# Altium schematic sheet BMS_Schematic.SchDoc
size 431 x 279 mm; SheetNumber: 1; SheetTotal: 1; ENG_APP_DATE: --/--/--; DSN_APP_DATE: --/--/--; CHK_APP_DATE: --/--/--
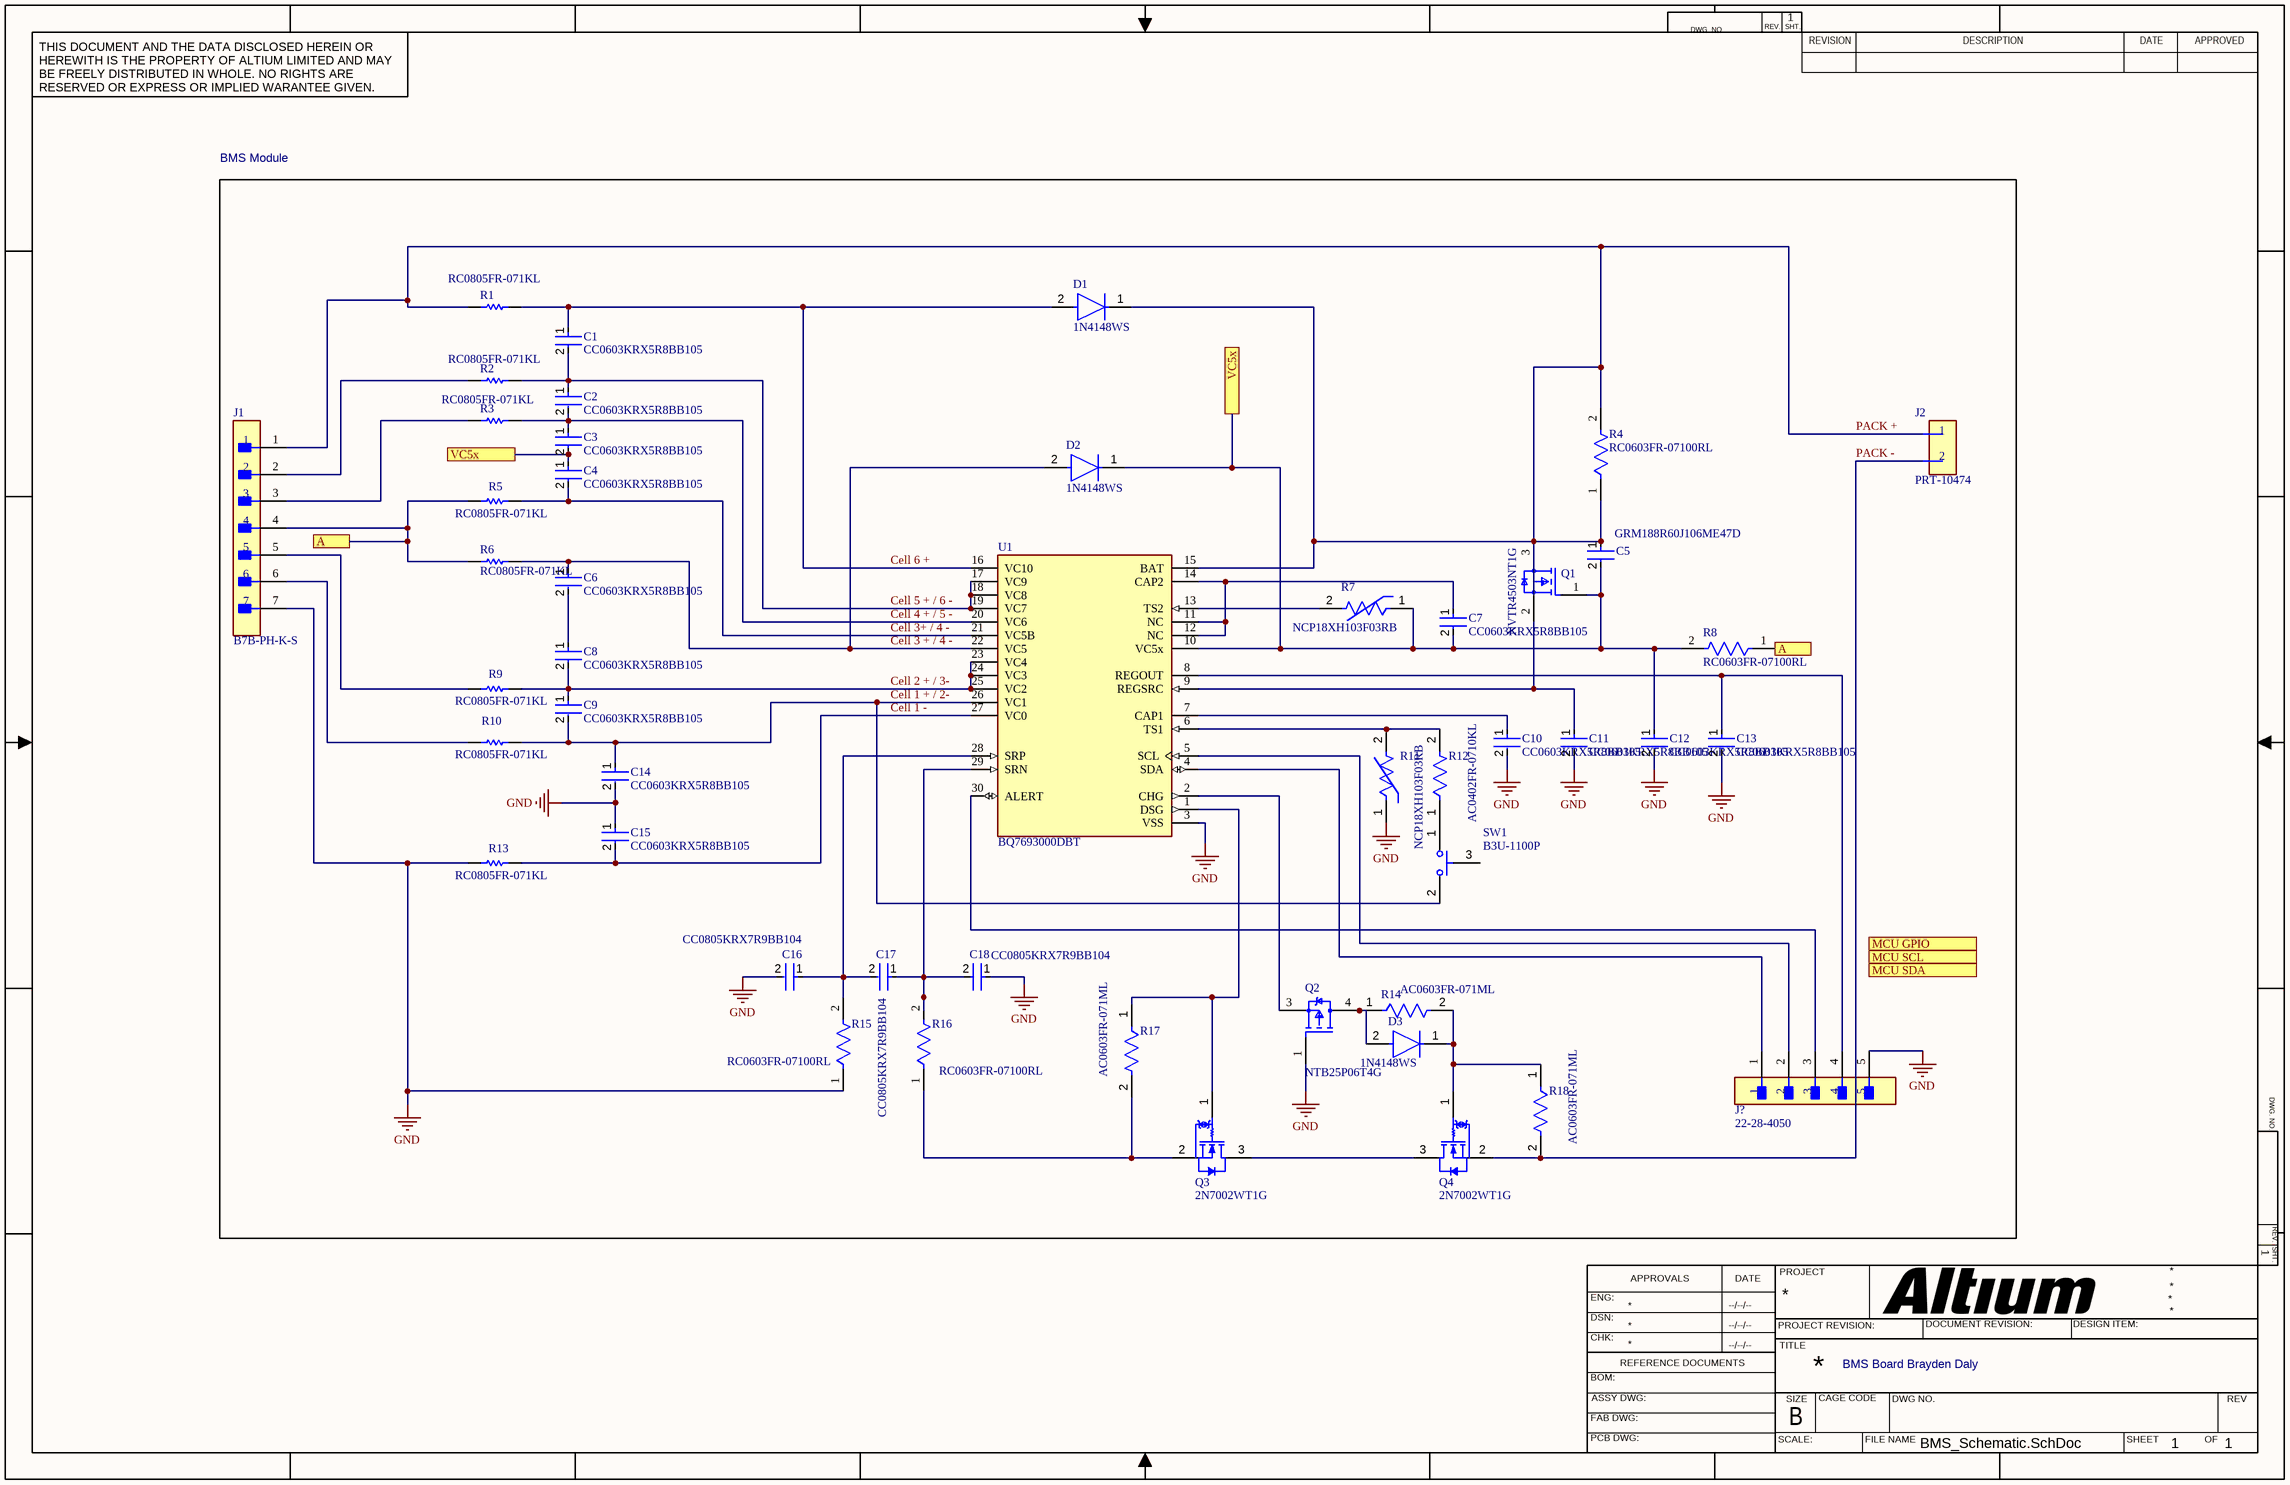
[diagram p0: BMS_Schematic.SchDoc]

## Parts
C1  CC0603KRX5R8BB105  [FP-CC0603-DA-MFG]
C2  CC0603KRX5R8BB105  [FP-CC0603-DA-MFG]
C3  CC0603KRX5R8BB105  [FP-CC0603-DA-MFG]
C4  CC0603KRX5R8BB105  [FP-CC0603-DA-MFG]
C5  GRM188R60J106ME47D  [FP-GRM188-0_1-e0_2_0_55-IPC_A]
C6  CC0603KRX5R8BB105  [FP-CC0603-DA-MFG]
C7  CC0603KRX5R8BB105  [FP-CC0603-DA-MFG]
C8  CC0603KRX5R8BB105  [FP-CC0603-DA-MFG]
C9  CC0603KRX5R8BB105  [FP-CC0603-DA-MFG]
C10  CC0603KRX5R8BB105  [FP-CC0603-DA-MFG]
C11  CC0603KRX5R8BB105  [FP-CC0603-DA-MFG]
C12  CC0603KRX5R8BB105  [FP-CC0603-DA-MFG]
C13  CC0603KRX5R8BB105  [FP-CC0603-DA-MFG]
C14  CC0603KRX5R8BB105  [FP-CC0603-DA-MFG]
C15  CC0603KRX5R8BB105  [FP-CC0603-DA-MFG]
C16  CC0805KRX7R9BB104  [FP-CC0805-0_85-MFG]
C17  CC0805KRX7R9BB104  [FP-CC0805-0_85-MFG]
C18  CC0805KRX7R9BB104  [FP-CC0805-0_85-MFG]
D1  1N4148WS  [FP-477AB-IPC_C]
D2  1N4148WS  [FP-477AB-IPC_C]
D3  1N4148WS  [FP-477AB-IPC_C]
J1  B7B-PH-K-S  [FP-B7B-PH-K-S-MFG]
J2  PRT-10474  [FP-PRT-10474-MFG]
J?  22-28-4050  [FP-22-28-4050-MFG]
Q1  NVTR4503NT1G  [On_Semiconductor_318-08_MFG]
Q2  NTB25P06T4G  [FP-418B-04-MFG]
Q3  2N7002WT1G  [ONSC-SC-70-3-419-04_V]
Q4  2N7002WT1G  [ONSC-SC-70-3-419-04_V]
R1  RC0805FR-071KL  [RESC2013X60X35ML10T20]
R2  RC0805FR-071KL  [RESC2013X60X35ML10T20]
R3  RC0805FR-071KL  [RESC2013X60X35ML10T20]
R4  RC0603FR-07100RL  [FP-RC0603-0_55-MFG]
R5  RC0805FR-071KL  [RESC2013X60X35ML10T20]
R6  RC0805FR-071KL  [RESC2013X60X35ML10T20]
R7  NCP18XH103F03RB  [FP-NCP18-0_15-IPC_A]
R8  RC0603FR-07100RL  [FP-RC0603-0_55-MFG]
R9  RC0805FR-071KL  [RESC2013X60X35ML10T20]
R10  RC0805FR-071KL  [RESC2013X60X35ML10T20]
R11  NCP18XH103F03RB  [FP-NCP18-0_15-IPC_A]
R12  AC0402FR-0710KL  [FP-AC0402-MFG]
R13  RC0805FR-071KL  [RESC2013X60X35ML10T20]
R14  AC0603FR-071ML  [FP-AC0603-IPC_C]
R15  RC0603FR-07100RL  [FP-RC0603-0_55-MFG]
R16  RC0603FR-07100RL  [FP-RC0603-0_55-MFG]
R17  AC0603FR-071ML  [FP-AC0603-IPC_C]
R18  AC0603FR-071ML  [FP-AC0603-IPC_C]
SW1  B3U-1100P  [FP-B3U-1100P-MFG]
U1  BQ7693000DBT  [FP-DBT0030A-IPC_A]

## Blocks framed on the sheet
BMS Module: C1-C18 D1-D3 J1 J2 J? Q1-Q4 R1-R18 SW1 U1

## Ports
A, MCU GPIO (out), MCU SCL (out), MCU SDA (out), VC5x

## Nets
GND: C10.2 C11.2 C12.2 C13.2 C14.2 C15.1 C16.2 C18.1 J1.7 J?.5 Q2.1(G) R11.1 R13.1 R15.1 U1.3(VSS)
A: J1.4 R5.1 R6.1 R8.1 ; port A
Cell 1 + / 2-: C9.2 C14.1 R10.2 SW1.2 U1.26(VC1)
Cell 1 -: C15.2 R13.2 U1.27(VC0)
Cell 2 + / 3-: C8.2 C9.1 R9.2 U1.23(VC4) U1.24(VC3) U1.25(VC2)
Cell 3 + / 4 -: C6.1 D2.2(A) R6.2 U1.22(VC5)
Cell 3+ / 4 -: C4.2 R5.2 U1.21(VC5B)
Cell 4 + / 5 -: C2.2 C3.1 R3.2 U1.20(VC6)
Cell 5 + / 6 -: C1.2 C2.1 R2.2 U1.17(VC9) U1.18(VC8) U1.19(VC7)
Cell 6 +: C1.1 D1.2(A) R1.2 U1.16(VC10)
PACK +: C5.1 D1.1(C) J1.1 Q1.3(Drain) R1.1 R4.1 R4.2 U1.15(BAT)
PACK -: Q4.2(S) R18.2
VC5x: C3.2 C4.1 C5.2 C7.2 C12.1 D2.1(C) Q1.1(Gate) R7.1 R8.2 U1.10(VC5x) ; port VC5x
NetC6_2: C6.2 C8.1
NetC7_1: C7.1 U1.11(NC) U1.12(NC) U1.14(CAP2)
NetC10_1: C10.1 U1.7(CAP1)
NetC11_1: C11.1 Q1.2(Source) U1.9(REGSRC)
NetC13_1: C13.1 J?.4 U1.8(REGOUT)
NetC16_1: C16.1 C17.2 R15.2 U1.28(SRP)
NetC17_1: C17.1 C18.2 R16.2 U1.29(SRN)
NetD3_1: D3.1(C) Q4.1(G) R14.2 R18.1
NetD3_2: D3.2(A) Q2.4(D) R14.1
NetJ1_2: J1.2 R2.1
NetJ1_3: J1.3 R3.1
NetJ1_5: J1.5 R9.1
NetJ1_6: J1.6 R10.1
NetJ?_1: J?.1 U1.4(SDA)
NetJ?_2: J?.2 U1.5(SCL)
NetJ?_3: J?.3 U1.30(ALERT)
NetQ2_3: Q2.3(S) U1.2(CHG)
NetQ3_1: Q3.1(G) R17.1 U1.1(DSG)
NetQ3_2: Q3.2(S) R16.1 R17.2
NetQ3_3: Q3.3(D) Q4.3(D)
NetR7_2: R7.2 U1.13(TS2)
NetR11_2: R11.2 R12.2 U1.6(TS1)
NetR12_1: R12.1 SW1.1

Not connected (* = marked no-connect by the designer): SW1 3

## Notes on the sheet
- BMS Board Brayden Daly
- DWG. NO.
- REV.
- SHT.
- THIS DOCUMENT AND THE DATA DISCLOSED HEREIN OR HEREWITH IS THE PROPERTY OF ALTIUM LIMITED AND MAY BE FREELY DISTRIBUTED IN WHOLE. NO RIGHTS ARE RESERVED OR EXPRESS OR IMPLIED WARANTEE GIVEN.
- REVISION
- DESCRIPTION
- DATE
- APPROVED
- ENG:
- APPROVALS
- PROJECT
- DSN:
- CHK:
- REFERENCE DOCUMENTS
- PROJECT REVISION:
- TITLE
- DOCUMENT REVISION:
- DESIGN ITEM:
- BOM:
- FAB DWG:
- PCB DWG:
- ASSY DWG:
- SCALE:
- SIZE
- B
- CAGE CODE
- FILE NAME
- DWG NO.
- SHEET
- OF
- REV
- (in symbol CMP-157536-000001-1) 1; 2

## Library data of the parts
C1-C4 C6-C15 = CMP-03422-000612-1: CAP CER 1UF 25V X5R 0603; Manufacturer: YAGEO; Description: CC0603 1 uF X5R 10.00% 25 V; Material: Ceramic; Tolerance: 0.1; Temperature Coefficient: 15%; Automotive: No; Octopart: https://octopart.com/cc0603krx5r8bb105-yageo-9292811; Package: CC0603-DA; Temperature Range High: +125°C; Digikey Description: CAP CER 1UF 25V X5R 0603; Mouser Description: Multilayer Ceramic Capacitors MLCC - SMD/SMT 1.0uF 25V X5R 10%; Device Class L2: Capacitors; Category: Cap; Value: 1 uF; Temperature: -55°C to +125°C; ComponentLink2URL: http://www.yageo.com/documents/recent/UPY-GPHC_X7R_6.3V-to-50V_18.pdf; Capacitance: 1 uF; ComponentLink2Description: Datasheet; Voltage: 25 V; Manufacturer Part Number: CC0603KRX5R8BB105; Height: 0.9mm; Device Class L3: Ceramic Capacitors; Temperature Characteristic: X5R; Footprint Url: http://www.yageo.com/exep/pages/download/literatures/UPY-C_GEN_24.pdf; Temperature Range Low: -55°C; Device Class L1: Passive Components; Voltage Rating: 25 V; Lead Free: Yes; RoHS: TRUE
C5 = CMP-2006-02792-2: Chip Multilayer Ceramic Capacitors for General Purpose, 0603, 10uF, X5R, 15%, 20%, 6.3V; Packaging: Tape and Reel; Voltage Rating (DC): 6.3V; Width: 0.031inch; Termination: SMD/SMT; Dielectric: X5R; Package Quantity: 4000; Voltage Rating: 6.3V; Capacitance: 10uF; Case/Package: 0603; Min Operating Temperature: -55°C; Voltage: 6.3V; Length: 1.6mm; Thickness: 0.035inch; Lead Free: Lead Free; Depth: 0.8mm; Case Code (Imperial): 0603; Max Operating Temperature: 85°C; Material: Ceramic; Height: 0.8mm; Tolerance: 20%; Mount: Surface Mount; REACH SVHC: No SVHC; Radiation Hardening: No; Case Code (Metric): 1608
C16-C18 = CMP-2100-03606-3: CAP CER 0.1UF 50V X7R 0805; Manufacturer: Yageo; Tolerance: 0.1; Capacitance: 100 nF; Value: 100 nF; Material: Ceramic; Device Class L1: Passive Components; ComponentLink2Description: Datasheet; Package: CC0805-0.85; Manufacturer Part Number: CC0805KRX7R9BB104; Digikey Description: CAP CER 0.1UF 50V X7R 0805; Device Class L3: Ceramic Capacitors; Temperature: -30°C to +85°C; Temperature Characteristic: X7R; Voltage Rating: 50 V; Height: 0.95mm; RoHS: TRUE; Ipc Land Pattern Name: CAPC200125X85; Device Class L2: Capacitors; Category: Cap; Temperature Range Low: -30°C; Temperature Range High: +85°C; Mouser Description: Multilayer Ceramic Capacitors MLCC - SMD/SMT 100nF 50V X7R 10%; Footprint Url: http://www.yageo.com/exep/pages/download/literatures/UPY-C_GEN_24.pdf; Automotive: No; Octopart: https://octopart.com/cc0805krx7r9bb104-yageo-192993; Lead Free: Yes; ComponentLink2URL: http://www.yageo.com/documents/recent/UPY-GPHC_Y5V_6.3V-to-50V_8.pdf
D1-D3 = CMP-07163-000040-1: DIODE GEN PURP 75V 150MA SOD323F; Forward Voltage: 1V; Power Dissipation: 200mW; Element Configuration: Single; Max Forward Surge Current (Ifsm): 2A; Peak Reverse Current: 5uA; Recovery Time: 4ns; Package Quantity: 1; Number of Pins: 2; Height: 1mm; REACH SVHC: No SVHC; Max Reverse Voltage (DC): 75V; Forward Current: 150mA; Length: 1.8mm; Max Repetitive Reverse Voltage (Vrrm): 75V; Max Operating Temperature: 150°C; Average Rectified Current: 150mA; Contact Plating: Tin; Packaging: Tape and Reel; Radiation Hardening: No; Min Operating Temperature: -55°C; Width: 1.35mm; Weight: 0.0276g; Lead Free: Lead Free; Mount: Surface Mount; Reverse Voltage: 75V; Reverse Recovery Time: 4ns
J1 = CMP-17439-000359-1: CONN HEADER VERT 7POS 2MM; Contact Resistance: 10mR; Current Rating: 2A; Pitch: 0.079inch; Test Voltage: 800V; Gender: Male; Insulation Resistance: 1GR; Connector Type: Male Pin; Number of Contacts: 7; Contact Mating Length: 0.13inch; Color: Natural; Contact Material: Bronze; Contact Plating: Tin; Series: PH; Housing Color: Natural; Fastening Type: Detent; Orientation: Vertical; Mount: Through Hole; Housing Material: Nylon; Contact Type: Male Pin; Packaging: Bulk; Lead Free: Contains Lead; Number of Rows: 1; Package Quantity: 500; Termination: Press-Fit; Number of Positions: 7
J2 = CMP-157536-000001-1: XT60 CONNECTORS MALE/FEMALE PAIR
J? = CMP-00257-00278173-1: 22-28-4050 KK® 254 Breakaway Header, Vertical, 5 Circuits, Tin (Sn) Plating, Mating Pin Length 6.09mm; NexarPartId: 278173; Voltage Rating: 250V; Number of Contacts: 5; Contact Resistance: 20mΩ; Gender: Male; Pitch: 2.54mm; Connector Type: Male Pin; Current Rating: 4A; Glow Wire Compliant: Non-compliant; Max Voltage Rating (DC): 250.25kV; Flammability Rating: UL94 V-0; Min Operating Temperature: 0°C; REACH SVHC: Unknown; Lead Free: Lead Free; Termination: Solder; RoHS: Compliant; Schedule B: 8536694040; Number of Circuits: 5; Mount: Through Hole; Lead Pitch: 2.54mm; Height: 2.29mm; Voltage Rating (DC): 250V; Max Operating Temperature: 75°C; Width: 2.49mm; Radiation Hardening: No; Contact Plating: Tin; Orientation: Vertical; Length: 12.7mm; Number of Rows: 1; Housing Material: Thermoplastic; Contact Material: Brass; Packaging: Bulk; Contact Mating Length: 6.096mm; Housing Color: Black; Color: Black; Number of Positions: 5
Q1 = CMP-1058-00743-2: Manufacturer Lifecycle Status: ACTIVE; NexarPartId: 18688338; Element Configuration: Single; Turn-Off Delay Time: 14ns; Max Junction Temperature (Tj): 150°C; Input Capacitance: 135pF; Drain to Source Resistance: 85mΩ; Number of Channels: 1; Gate to Source Voltage (Vgs): 20V; Continuous Drain Current (ID): 1.5A; Turn-On Delay Time: 5.8ns; Power Dissipation: 420mW; Drain to Source Breakdown Voltage: 36V; Drain to Source Voltage (Vdss): 30V; Rds On Max: 110mΩ; Radiation Hardening: No; RoHS: Compliant; Schedule B: 8541210080, 8541210080; Lifecycle Status: Production; Case/Package: SOT-23; Width: 1.4mm; Number of Pins: 3; Height: 1.01mm; Length: 3.04mm; Max Operating Temperature: 150°C; Packaging: Digi-Reel®; Number of Elements: 1; Max Power Dissipation: 420mW; Lead Free: Lead Free; Min Operating Temperature: -55°C
Q2 = CMP-1058-00100-2: Manufacturer Lifecycle Status: ACTIVE; NexarPartId: 341266; Turn-On Delay Time: 14ns; Number of Elements: 1; Max Junction Temperature (Tj): 175°C; Power Dissipation: 120W; Voltage Rating (DC): -60V; Gate to Source Voltage (Vgs): 15V; Drain to Source Resistance: 65mΩ; Current Rating: -25A; Turn-Off Delay Time: 43ns; Continuous Drain Current (ID): 27.5A; Rds On Max: 82mΩ; Rise Time: 72ns; Fall Time: 190ns; Input Capacitance: 1.68nF; Element Configuration: Single; Max Operating Temperature: 175°C; Length: 10.29mm; Min Operating Temperature: -55°C; RoHS: Compliant; Number of Channels: 1; Width: 9.65mm; Lifecycle Status: Production; Case/Package: D2PAK; Radiation Hardening: No; Max Power Dissipation: 120W; Schedule B: 8541290080, 8541290080; Lead Free: Lead Free; Contact Plating: Tin; Drain to Source Voltage (Vdss): -60V; Drain to Source Breakdown Voltage: -60V; Number of Pins: 3; Packaging: Digi-Reel®; Height: 4.83mm
Q3 Q4 = CMP-1058-00618-1: Small Signal MOSFET, 60 V, 340 mA, Single, N-Channel, 3-Pin SC70, Pb-Free, Tape and Reel; Manufacturer: On Semiconductor; Crss Typ (pF): 2.2; Coss Typ (pF): 4.2; VGS(th) Max (V): 2.5; Channel Polarity: N Channel; ID Max (A): 0.34; VGS Max (V): 20; V(BR)DSS Min (V): 60; Ciss Typ (pF): 24.5; Configuration: Single; Packing: Tape and Reel; Package Type: SC-70-3 / SOT-323-3; RoHS: Pb-Free; ComponentLink3Description: Package Specification; PackageReference: SC-70-3-419-04; Mounting Technology: Surface Mount; PackageVersion: Rev. N, 11/2008; ComponentLink2URL: http://www.onsemi.com/pub_link/Collateral/2N7002W-D.PDF; PartNumber: 2N7002WT1G; ComponentLink2Description: Datasheet; ComponentLink3URL: http://www.onsemi.cn/pub_link/Collateral/419-04.PDF; ComponentLink1Description: Manufacturer URL; ComponentLink1URL: http://www.onsemi.com/; DatasheetVersion: Rev. 5; PackageDescription: 3-Pin Small Outline Transistor, Body 2 x 1.25 mm, Pitch 0.65 mm
R1-R3 R5 R6 R9 R10 R13 = CMP-2100-03671-1: Chip Resistor, 1 KOhm, +/- 1%, 125 mW, -55 to 155 degC, 0805 (2012 Metric), RoHS, Tape and Reel; Manufacturer: Yageo; Temperature Coefficient: 100ppm/degreesC; Voltage Rating (DC): 150V; Max Power Dissipation: 125mW; Resistance: 1KOhm; Number of Pins: 2; Number of Terminations: 2; Datasheet URL: http://www.yageo.com/NewPortal/yageodocoutput?fileName=/pdf/R-Chip/PYu-RC_Group_51_RoHS_L_5.pdf; Length: 0.079inch; Package Description: 2-Pin Surface Mounted Device, Body 2 x 1.25 mm; Depth: 1.25mm; Height: 0.024inch; Military Standard: Not; Case/Package: 0805; Package Reference: 0805; RoHSCompliant: true; Lead Free: LeadFree; Packaging: TapeandReel; Package Quantity: 1; Datasheet Version: Rev. 5, 10/2016; Tolerance: 1%; Min Operating Temperature: -55degC; Voltage Rating: 150V; Composition: ThickFilm; Case Code (Imperial): 0805; Power Rating: 125mW; Width: 0.049inch; Case Code (Metric): 2012; Manufacturer URL: http://www.yageo.com/; Max Operating Temperature: 155degC; REACH SVHC: Unknown; Termination: SMD/SMT
R4 R8 R15 R16 = CMP-2100-03663-2: NexarPartId: 55402879; Voltage Rating: 50V; Power Rating: 100mW; Tolerance: 1%; Temperature Coefficient: 100ppm/°C; Resistance: 100Ω; Case/Package: 0603; Military Standard: Not; REACH SVHC: Unknown; Case Code (Metric): 0603; Max Operating Temperature: 155°C; Schedule B: 8533210045, 8533210045; Height: 450µm; Length: 1.6mm; Lead Free: Lead Free; Packaging: Tape & Reel; Case Code (Imperial): 0603; Composition: Thick Film; Min Operating Temperature: -55°C; Voltage Rating (DC): 50V; RoHS: Compliant; Depth: 800µm; Number of Pins: 2; Termination: SMD/SMT; Width: 800µm
R7 R11 = CMP-2000-05271-3: NTC Thermistor for Temperature Sensor, 0603, 10kΩ, 1%, 0.1mA, 5V; Manufacturer Series: NCP18; Accuracy: 0.7%; Current Rating: 310uA; Max Power Dissipation: 100mW; Thermistor Application: TEMPERATURE COMPENSATION; Number of Terminals/Pins: 2; Resistance: 10kR; Case Code (Metric): 1608; RoHS Compliant: Yes; Max Operating Temperature: 125°C; Resistance Tolerance: 1%; Case/Package: 0603; Mount: Surface Mount; Lead Free: Lead Free; Min Operating Temperature: -40°C; REACH SVHC: No SVHC; Package Shape: Rectangular; Radiation Hardening: No; Series: NCP; Depth: 0.8mm; Number of Pins: 2; Length: 1.6mm; Height: 0.8mm; Terminal Placement: Dual; Tolerance: 1%; Case Code (Imperial): 0603; Terminal Finish: Tin; Power Rating: 100mW; Termination: SMD/SMT; Packaging: Tape and Reel; Package Quantity: 1
R12 = CMP-2002-01790-3: RES 10kΩ ±1% 0.063W 0402; Power Rating: 62.5mW; Voltage Rating: 50V; Temperature Coefficient: 100ppm/°C; Resistance: 10kR; Max Power Dissipation: 63mW; Tolerance: 1%; Military Standard: Not; Construction: Rectangular; Termination: SMD/SMT; Max Operating Temperature: 155°C; Min Operating Temperature: -55°C; Height: 0.015inch; Lead Free: Lead Free; Width: 0.02inch; Case/Package: 0402; Resistor Type: Thick Film; Series: AC; Features: Moisture Resistant; RoHS Compliant: Yes; Number of Terminations: 2; Case Code (Metric): 1005; Length: 0.039inch; Depth: 0.5mm; Size Code: 0402; Packaging: Tape and Reel; Case Code (Imperial): 0402
R14 R17 R18 = CMP-2000-04829-2: RES 1MΩ 1.00% 0.1W 0603; Voltage Rating: 50V; Tolerance: 1%; Max Power Dissipation: 100mW; Resistance: 1MR; Temperature Coefficient: 100ppm/°C; Length: 0.063inch; Packaging: Tape and Reel; Number of Terminations: 2; Width: 0.031inch; Case/Package: 0603; Max Operating Temperature: 155°C; Height: 0.022inch; Termination: SMD/SMT; Series: AC; Min Operating Temperature: -55°C; Case Code (Metric): 1608; Resistor Type: Thick Film; Power Rating: 100mW; Case Code (Imperial): 0603; RoHS Compliant: Yes; Features: Moisture Resistant; Lead Free: Lead Free; Package Quantity: 1; Ratings: AEC-Q200
SW1 = CMP-2000-05903-2: SWITCH TACTILE SPST-NO 0.05A 12V; Switch Function: Off-Mom; Operating Force: 1.5N; Mechanical Life: 200000Cycles; Max Current Rating: 50mA; Illumination Type: Non-Illuminated; Actuator Type: Standard; Throw Configuration: SPST; Switch Travel: 0.15mm; Contact Resistance: 100mR; Actuator Length: 0.4mm; Ratings: Dust Proof; Termination: SMD/SMT; Packaging: Tape and Reel; Contact Plating: Silver; Max Operating Temperature: 70°C; Current Rating: 50mA; Electrical Life: 200000Cycles; Voltage Rating (DC): 12V; Length: 3.15mm; Weight: 0.022g; Min Operating Temperature: -25°C; Orientation: Straight; Contact Current Rating: 50mA; Package Quantity: 1; Max Voltage Rating (DC): 12V; Depth: 4mm; Lead Free: Lead Free; Mount: Surface Mount
U1 = CMP-04911-000035-1: IC BATT MGMT LI-ION AFE 30TSSOP; Interface: I2C; Output Voltage: 3.6V; Fault Protection: Over Current; Operating Supply Voltage: 25V; Weight: 0.003439oz; Package Quantity: 60; Packaging: Rail/Tube; Lead Free: Lead Free; Case/Package: TSSOP; Min Operating Temperature: -40°C; Number of Pins: 30; RoHS Compliant: Yes; Max Operating Temperature: 85°C; Mount: Surface Mount; Contact Plating: Gold